# Altium schematic sheet RPI_CM5_PINOUT.SchDoc
size C; SheetNumber: 3; SheetTotal: 20
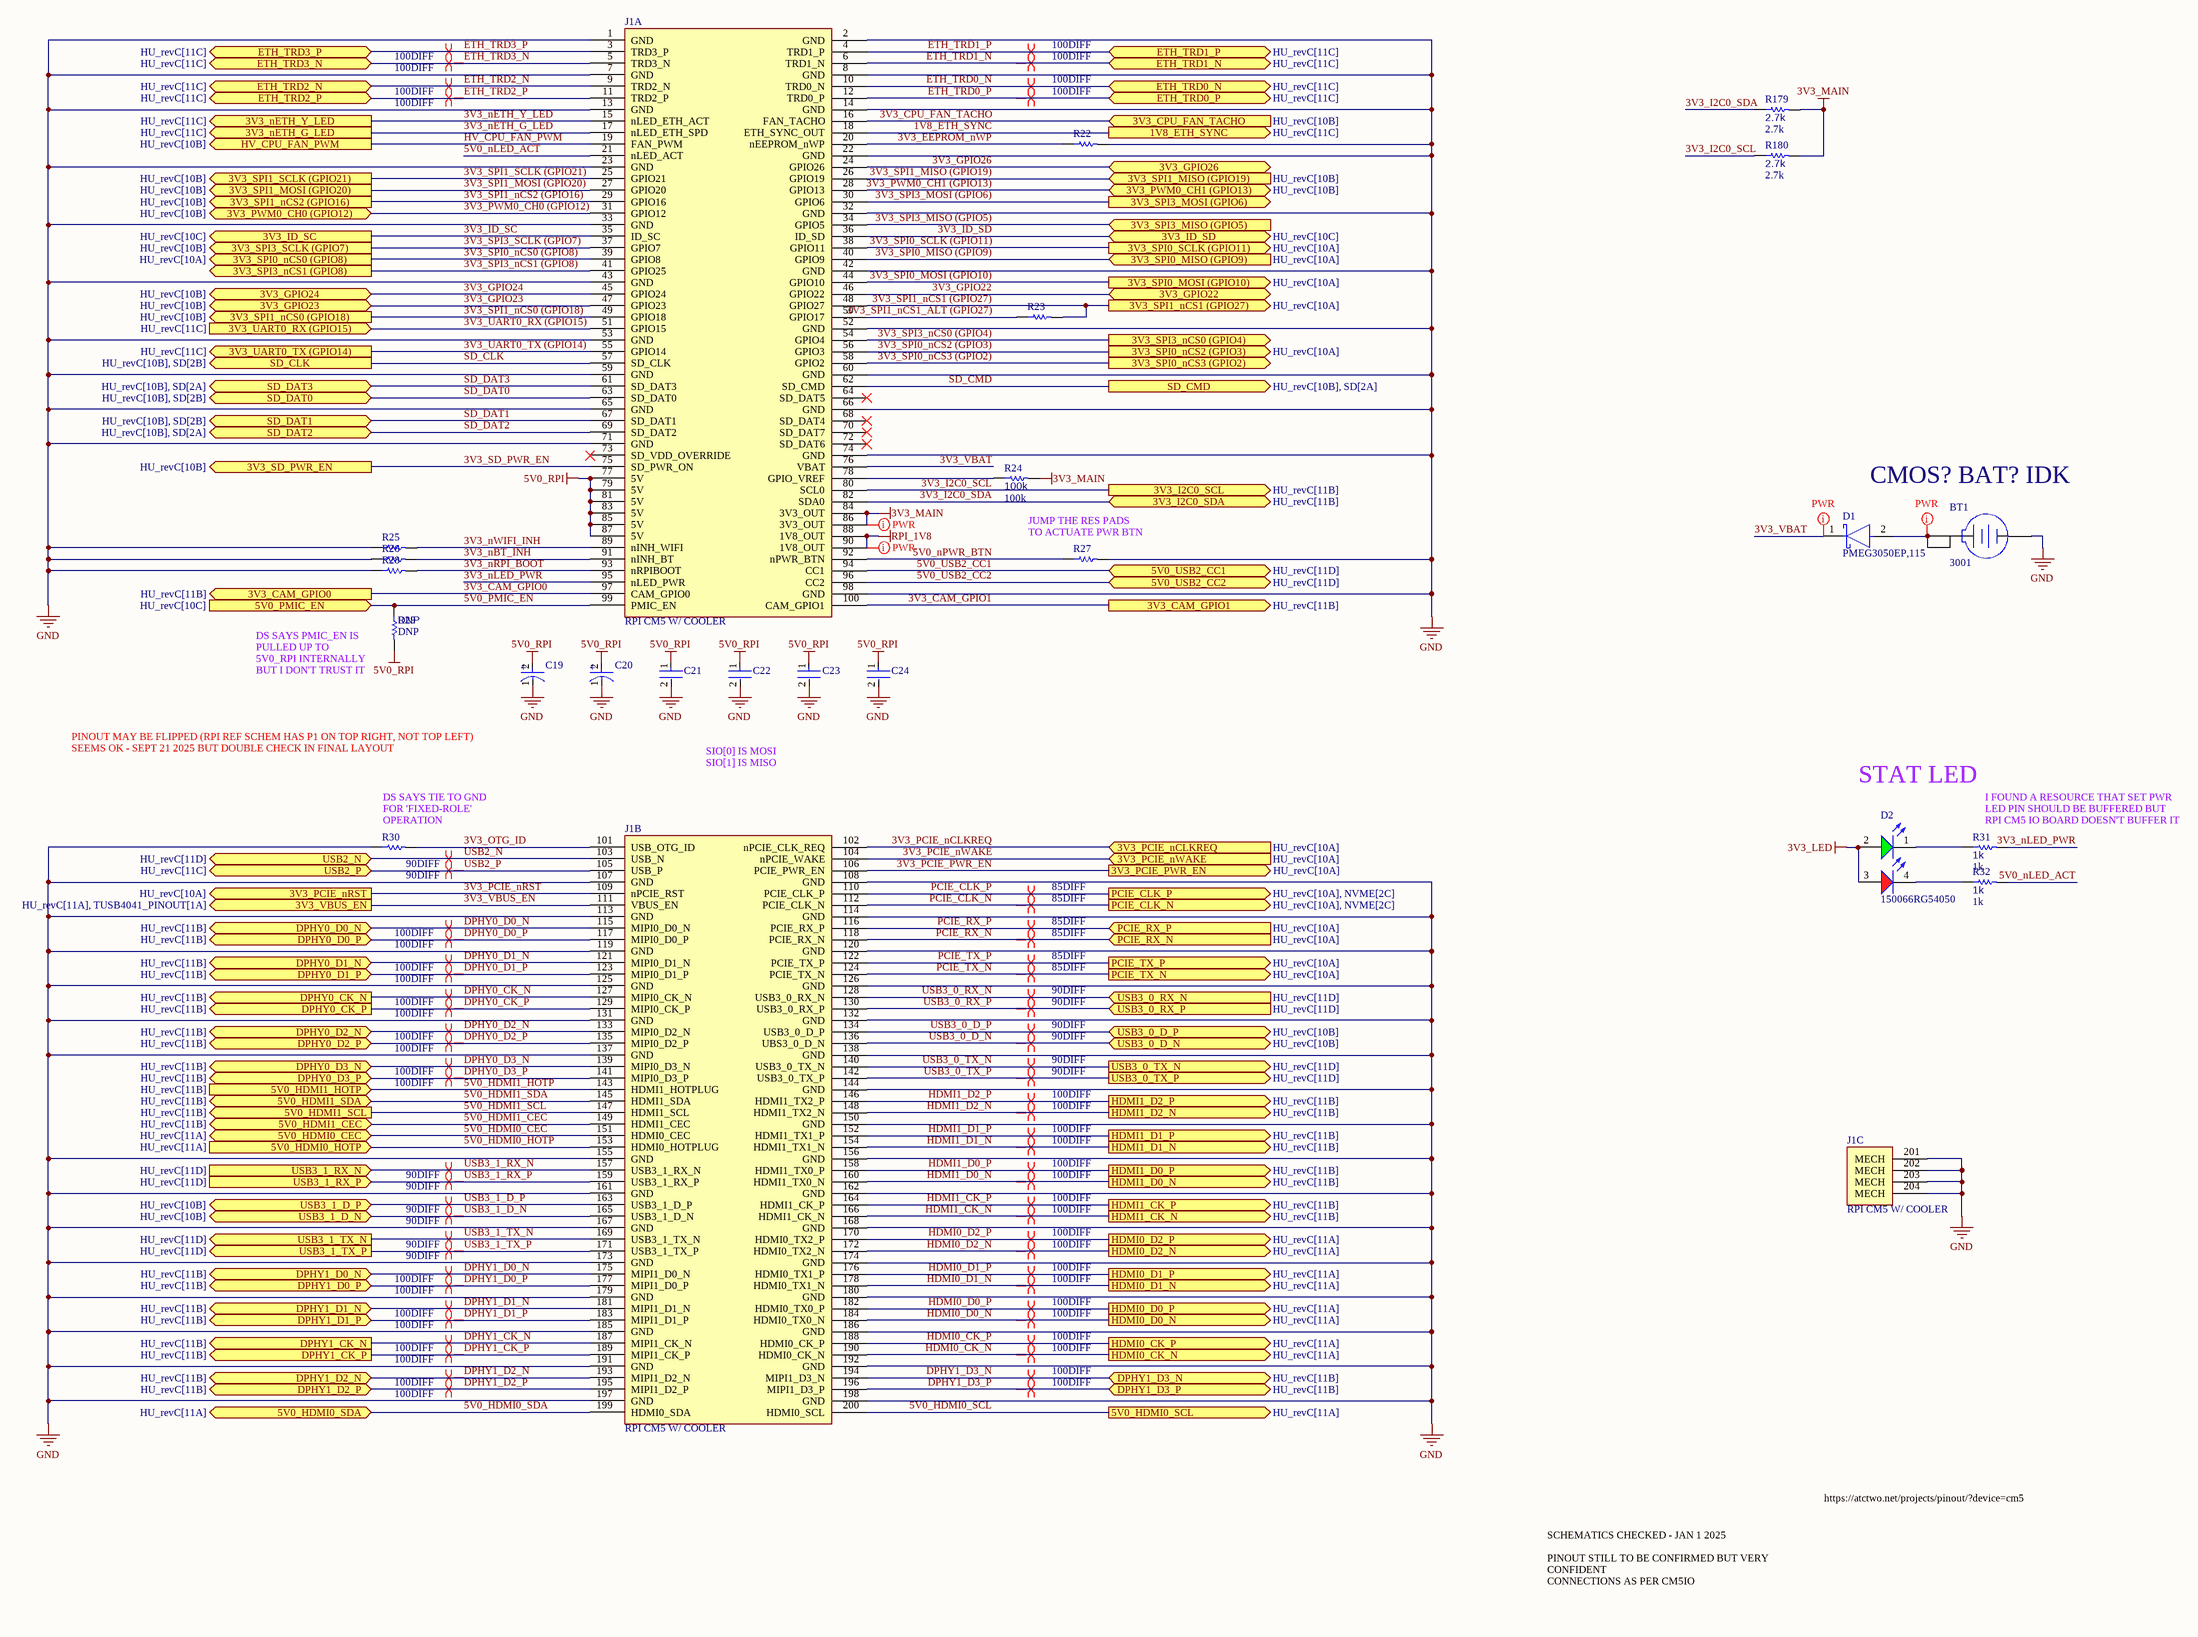
[diagram p0: RPI_CM5_PINOUT.SchDoc]

## Parts
BT1  3001  [KSTN-3001_V]
C19  T491X107K025AT  [FP-T491X107K025AT-MFG]  (value not drawn)
C20  T491X107K025AT  [FP-T491X107K025AT-MFG]  (value not drawn)
C21  C3225X7R1H106M250AC  [FP-C3225-250-0_4-MFG]  (value not drawn)
C22  C3225X7R1H106M250AC  [FP-C3225-250-0_4-MFG]  (value not drawn)
C23  GRM21BR61E226ME44L  [FP-GRM21B-0_2-e0_2_0_7-IPC_B]  (value not drawn)
C24  GRM21BR61E226ME44L  [FP-GRM21B-0_2-e0_2_0_7-IPC_B]  (value not drawn)
D1  PMEG3050EP,115  [FP-SOD128-MFG]
D2  150066RG54050  [WL-SBCD_0606]
J1  RPI CM5 W/ COOLER  [RPI CM5 W_ COOLER-Footprint-1]  (parts A,B,C of 3)
R22  DNP  [RESC1005X40X25ML05T05]  (value not drawn)
R23  DNP  [RESC1005X40X25ML05T05]  (value not drawn)
R24  100k  [R0603B]
R25  DNP  [RESC1005X40X25ML05T05]  (value not drawn)
R26  DNP  [RESC1005X40X25ML05T05]  (value not drawn)
R27  DNP  [RESC1005X40X25ML05T05]  (value not drawn)
R28  DNP  [RESC1005X40X25ML05T05]  (value not drawn)
R29  DNP  [R0603B]
R30  DNP  [RESC1005X40X25ML05T05]  (value not drawn)
R31  1k  [R0603B]
R32  1k  [R0603B]
R179  2.7k  [R0603B]
R180  2.7k  [R0603B]

## Ports
1V8_ETH_SYNC (out, see HU_revC[11C]), 3V3_CAM_GPIO0 (out, see HU_revC[11B]), 3V3_CAM_GPIO1 (out, see HU_revC[11B]), 3V3_CPU_FAN_TACHO (in, see HU_revC[10B]), 3V3_GPIO22 (bidir), 3V3_GPIO23 (bidir, see HU_revC[10B]), 3V3_GPIO24 (bidir, see HU_revC[10B]), 3V3_GPIO26 (bidir), 3V3_I2C0_SCL (out, see HU_revC[11B]), 3V3_I2C0_SDA (bidir, see HU_revC[11B]), 3V3_ID_SC (out, see HU_revC[10C]), 3V3_ID_SD (bidir, see HU_revC[10C]), 3V3_nETH_G_LED (out, see HU_revC[11C]), 3V3_nETH_Y_LED (out, see HU_revC[11C]), 3V3_PCIE_nCLKREQ (in, see HU_revC[10A]), 3V3_PCIE_nRST (out, see HU_revC[10A]), 3V3_PCIE_nWAKE (in, see HU_revC[10A]), 3V3_PCIE_PWR_EN (out, see HU_revC[10A]), 3V3_PWM0_CH0 (GPIO12) (bidir, see HU_revC[10B]), 3V3_PWM0_CH1 (GPIO13) (bidir, see HU_revC[10B]), 3V3_SD_PWR_EN (out, see HU_revC[10B]), 3V3_SPI0_MISO (GPIO9) (in, see HU_revC[10A]), 3V3_SPI0_MOSI (GPIO10) (out, see HU_revC[10A]), 3V3_SPI0_nCS0 (GPIO8) (out, see HU_revC[10A]), 3V3_SPI0_nCS2 (GPIO3) (out, see HU_revC[10A]), 3V3_SPI0_nCS3 (GPIO2) (out), 3V3_SPI0_SCLK (GPIO11) (out, see HU_revC[10A]), 3V3_SPI1_MISO (GPIO19) (in, see HU_revC[10B]), 3V3_SPI1_MOSI (GPIO20) (out, see HU_revC[10B]), 3V3_SPI1_nCS0 (GPIO18) (out, see HU_revC[10B]), 3V3_SPI1_nCS1 (GPIO27) (out, see HU_revC[10A]), 3V3_SPI1_nCS2 (GPIO16) (out, see HU_revC[10B]), 3V3_SPI1_SCLK (GPIO21) (out, see HU_revC[10B]), 3V3_SPI3_MISO (GPIO5) (in), 3V3_SPI3_MOSI (GPIO6) (out), 3V3_SPI3_nCS0 (GPIO4) (out), 3V3_SPI3_nCS1 (GPIO8) (out), 3V3_SPI3_SCLK (GPIO7) (out, see HU_revC[10B]), 3V3_UART0_RX (GPIO15) (in, see HU_revC[11C]), 3V3_UART0_TX (GPIO14) (out, see HU_revC[11C]), 3V3_VBUS_EN (out, see HU_revC[11A], TUSB4041_PINOUT[1A]), 5V0_HDMI0_CEC (bidir, see HU_revC[11A]), 5V0_HDMI0_HOTP (in, see HU_revC[11A]), 5V0_HDMI0_SCL (out, see HU_revC[11A]), 5V0_HDMI0_SDA (bidir, see HU_revC[11A]), 5V0_HDMI1_CEC (bidir, see HU_revC[11B]), 5V0_HDMI1_HOTP (in, see HU_revC[11B]), 5V0_HDMI1_SCL (out, see HU_revC[11B]), 5V0_HDMI1_SDA (bidir, see HU_revC[11B]), 5V0_PMIC_EN (in, see HU_revC[10C]), 5V0_USB2_CC1 (bidir, see HU_revC[11D]), 5V0_USB2_CC2 (bidir, see HU_revC[11D]), DPHY0_CK_N (out, see HU_revC[11B]), DPHY0_CK_P (out, see HU_revC[11B]), DPHY0_D0_N (bidir, see HU_revC[11B]), DPHY0_D0_P (bidir, see HU_revC[11B]), DPHY0_D1_N (bidir, see HU_revC[11B]), DPHY0_D1_P (bidir, see HU_revC[11B]), DPHY0_D2_N (bidir, see HU_revC[11B]), DPHY0_D2_P (bidir, see HU_revC[11B]), DPHY0_D3_N (bidir, see HU_revC[11B]), DPHY0_D3_P (bidir, see HU_revC[11B]), DPHY1_CK_N (out, see HU_revC[11B]), DPHY1_CK_P (out, see HU_revC[11B]), DPHY1_D0_N (bidir, see HU_revC[11B]), DPHY1_D0_P (bidir, see HU_revC[11B]), DPHY1_D1_N (bidir, see HU_revC[11B]), DPHY1_D1_P (bidir, see HU_revC[11B]), DPHY1_D2_N (bidir, see HU_revC[11B]), DPHY1_D2_P (bidir, see HU_revC[11B]), DPHY1_D3_N (bidir, see HU_revC[11B]), DPHY1_D3_P (bidir, see HU_revC[11B]), ETH_TRD0_N (bidir, see HU_revC[11C]), ETH_TRD0_P (bidir, see HU_revC[11C]), ETH_TRD1_N (bidir, see HU_revC[11C]), ETH_TRD1_P (bidir, see HU_revC[11C]), ETH_TRD2_N (bidir, see HU_revC[11C]), ETH_TRD2_P (bidir, see HU_revC[11C]), ETH_TRD3_N (bidir, see HU_revC[11C]), ETH_TRD3_P (bidir, see HU_revC[11C]), HDMI0_CK_N (out, see HU_revC[11A]), HDMI0_CK_P (out, see HU_revC[11A]), HDMI0_D0_N (out, see HU_revC[11A]), HDMI0_D0_P (out, see HU_revC[11A]), HDMI0_D1_N (out, see HU_revC[11A]), HDMI0_D1_P (out, see HU_revC[11A]), HDMI0_D2_N (out, see HU_revC[11A]), HDMI0_D2_P (out, see HU_revC[11A]), HDMI1_CK_N (out, see HU_revC[11B]), HDMI1_CK_P (out, see HU_revC[11B]), HDMI1_D0_N (out, see HU_revC[11B]), HDMI1_D0_P (out, see HU_revC[11B]), HDMI1_D1_N (out, see HU_revC[11B]), HDMI1_D1_P (out, see HU_revC[11B]), HDMI1_D2_N (out, see HU_revC[11B]), HDMI1_D2_P (out, see HU_revC[11B]), HV_CPU_FAN_PWM (out, see HU_revC[10B]), PCIE_CLK_N (out, see HU_revC[10A], NVME[2C]), PCIE_CLK_P (out, see HU_revC[10A], NVME[2C]), PCIE_RX_N (in, see HU_revC[10A]), PCIE_RX_P (in, see HU_revC[10A]), PCIE_TX_N (out, see HU_revC[10A]), PCIE_TX_P (out, see HU_revC[10A]), SD_CLK (out, see HU_revC[10B], SD[2B]), SD_CMD (out, see HU_revC[10B], SD[2A]), SD_DAT0 (bidir, see HU_revC[10B], SD[2B]), SD_DAT1 (bidir, see HU_revC[10B], SD[2B]), SD_DAT2 (bidir, see HU_revC[10B], SD[2A]), SD_DAT3 (bidir, see HU_revC[10B], SD[2A]), USB2_N (bidir, see HU_revC[11D]), USB2_P (bidir, see HU_revC[11C]), USB3_0_D_N (bidir, see HU_revC[10B]), USB3_0_D_P (bidir, see HU_revC[10B]), USB3_0_RX_N (in, see HU_revC[11D]), USB3_0_RX_P (in, see HU_revC[11D]), USB3_0_TX_N (out, see HU_revC[11D]), USB3_0_TX_P (out, see HU_revC[11D]), USB3_1_D_N (bidir, see HU_revC[10B]), USB3_1_D_P (bidir, see HU_revC[10B]), USB3_1_RX_N (in, see HU_revC[11D]), USB3_1_RX_P (in, see HU_revC[11D]), USB3_1_TX_N (out, see HU_revC[11D]), USB3_1_TX_P (out, see HU_revC[11D])

## Nets
3V3_LED: D2.2(A) D2.3(A)
3V3_MAIN: J1.84(3V3_OUT) J1.86(3V3_OUT) R24.2 R179.2 R180.2
5V0_RPI: C19.2(A) C20.2(A) C21.1 C22.1 C23.1 C24.1 J1.77(5V) J1.79(5V) J1.81(5V) J1.83(5V) J1.85(5V) J1.87(5V) R29.2
GND: BT1.3(-) C19.1(C) C20.1(C) C21.2 C22.2 C23.2 C24.2 J1.1(GND) J1.2(GND) J1.7(GND) J1.8(GND) J1.13(GND) J1.14(GND) J1.22(GND) J1.23(GND) J1.32(GND) J1.33(GND) J1.42(GND) J1.43(GND) J1.52(GND) J1.53(GND) J1.59(GND) J1.60(GND) J1.65(GND) J1.66(GND) J1.71(GND) J1.74(GND) J1.98(GND) J1.107(GND) J1.108(GND) J1.113(GND) J1.114(GND) J1.119(GND) J1.120(GND) J1.125(GND) J1.126(GND) J1.131(GND) J1.132(GND) J1.137(GND) J1.138(GND) J1.144(GND) J1.150(GND) J1.155(GND) J1.156(GND) J1.161(GND) J1.162(GND) J1.167(GND) J1.168(GND) J1.173(GND) J1.174(GND) J1.179(GND) J1.180(GND) J1.185(GND) J1.186(GND) J1.191(GND) J1.192(GND) J1.197(GND) J1.198(GND) J1.201(MECH) J1.202(MECH) J1.203(MECH) J1.204(MECH) R22.2 R25.1 R26.1 R27.2 R28.1 R30.1
RPI_1V8: J1.88(1V8_OUT) J1.90(1V8_OUT)
1V8_ETH_SYNC: J1.18(ETH_SYNC_OUT) ; port 1V8_ETH_SYNC
3V3_CAM_GPIO0: J1.97(CAM_GPIO0) ; port 3V3_CAM_GPIO0
3V3_CAM_GPIO1: J1.100(CAM_GPIO1) ; port 3V3_CAM_GPIO1
3V3_CPU_FAN_TACHO: J1.16(FAN_TACHO) ; port 3V3_CPU_FAN_TACHO
3V3_EEPROM_nWP: J1.20(nEEPROM_nWP) R22.1
3V3_GPIO22: J1.46(GPIO22) ; port 3V3_GPIO22
3V3_GPIO23: J1.47(GPIO23) ; port 3V3_GPIO23
3V3_GPIO24: J1.45(GPIO24) ; port 3V3_GPIO24
3V3_GPIO26: J1.24(GPIO26) ; port 3V3_GPIO26
3V3_I2C0_SCL: J1.80(SCL0) R180.1 ; port 3V3_I2C0_SCL
3V3_I2C0_SDA: J1.82(SDA0) R179.1 ; port 3V3_I2C0_SDA
3V3_ID_SC: J1.35(ID_SC) ; port 3V3_ID_SC
3V3_ID_SD: J1.36(ID_SD) ; port 3V3_ID_SD
3V3_nBT_INH: J1.91(nINH_BT) R26.2
3V3_nETH_G_LED: J1.17(nLED_ETH_SPD) ; port 3V3_nETH_G_LED
3V3_nETH_Y_LED: J1.15(nLED_ETH_ACT) ; port 3V3_nETH_Y_LED
3V3_nLED_PWR: J1.95(nLED_PWR) R31.2
3V3_nRPI_BOOT: J1.93(nRPIBOOT) R28.2
3V3_nWIFI_INH: J1.89(nINH_WIFI) R25.2
3V3_OTG_ID: J1.101(USB_OTG_ID) R30.2
3V3_PCIE_nCLKREQ: J1.102(nPCIE_CLK_REQ) ; port 3V3_PCIE_nCLKREQ
3V3_PCIE_nRST: J1.109(nPCIE_RST) ; port 3V3_PCIE_nRST
3V3_PCIE_nWAKE: J1.104(nPCIE_WAKE) ; port 3V3_PCIE_nWAKE
3V3_PCIE_PWR_EN: J1.106(PCIE_PWR_EN) ; port 3V3_PCIE_PWR_EN
3V3_PWM0_CH0 (GPIO12): J1.31(GPIO12) ; port 3V3_PWM0_CH0 (GPIO12)
3V3_PWM0_CH1 (GPIO13): J1.28(GPIO13) ; port 3V3_PWM0_CH1 (GPIO13)
3V3_SD_PWR_EN: J1.75(SD_PWR_ON) ; port 3V3_SD_PWR_EN
3V3_SPI0_MISO (GPIO9): J1.40(GPIO9) ; port 3V3_SPI0_MISO (GPIO9)
3V3_SPI0_MOSI (GPIO10): J1.44(GPIO10) ; port 3V3_SPI0_MOSI (GPIO10)
3V3_SPI0_nCS0 (GPIO8): J1.39(GPIO8) ; port 3V3_SPI0_nCS0 (GPIO8)
3V3_SPI0_nCS2 (GPIO3): J1.56(GPIO3) ; port 3V3_SPI0_nCS2 (GPIO3)
3V3_SPI0_nCS3 (GPIO2): J1.58(GPIO2) ; port 3V3_SPI0_nCS3 (GPIO2)
3V3_SPI0_SCLK (GPIO11): J1.38(GPIO11) ; port 3V3_SPI0_SCLK (GPIO11)
3V3_SPI1_MISO (GPIO19): J1.26(GPIO19) ; port 3V3_SPI1_MISO (GPIO19)
3V3_SPI1_MOSI (GPIO20): J1.27(GPIO20) ; port 3V3_SPI1_MOSI (GPIO20)
3V3_SPI1_nCS0 (GPIO18): J1.49(GPIO18) ; port 3V3_SPI1_nCS0 (GPIO18)
3V3_SPI1_nCS1 (GPIO27): J1.48(GPIO27) R23.2 ; port 3V3_SPI1_nCS1 (GPIO27)
3V3_SPI1_nCS1_ALT (GPIO27): J1.50(GPIO17) R23.1
3V3_SPI1_nCS2 (GPIO16): J1.29(GPIO16) ; port 3V3_SPI1_nCS2 (GPIO16)
3V3_SPI1_SCLK (GPIO21): J1.25(GPIO21) ; port 3V3_SPI1_SCLK (GPIO21)
3V3_SPI3_MISO (GPIO5): J1.34(GPIO5) ; port 3V3_SPI3_MISO (GPIO5)
3V3_SPI3_MOSI (GPIO6): J1.30(GPIO6) ; port 3V3_SPI3_MOSI (GPIO6)
3V3_SPI3_nCS0 (GPIO4): J1.54(GPIO4) ; port 3V3_SPI3_nCS0 (GPIO4)
3V3_SPI3_nCS1 (GPIO8): J1.41(GPIO25) ; port 3V3_SPI3_nCS1 (GPIO8)
3V3_SPI3_SCLK (GPIO7): J1.37(GPIO7) ; port 3V3_SPI3_SCLK (GPIO7)
3V3_UART0_RX (GPIO15): J1.51(GPIO15) ; port 3V3_UART0_RX (GPIO15)
3V3_UART0_TX (GPIO14): J1.55(GPIO14) ; port 3V3_UART0_TX (GPIO14)
3V3_VBAT: D1.1(C) J1.76(VBAT)
3V3_VBUS_EN: J1.111(VBUS_EN) ; port 3V3_VBUS_EN
5V0_HDMI0_CEC: J1.151(HDMI0_CEC) ; port 5V0_HDMI0_CEC
5V0_HDMI0_HOTP: J1.153(HDMI0_HOTPLUG) ; port 5V0_HDMI0_HOTP
5V0_HDMI0_SCL: J1.200(HDMI0_SCL) ; port 5V0_HDMI0_SCL
5V0_HDMI0_SDA: J1.199(HDMI0_SDA) ; port 5V0_HDMI0_SDA
5V0_HDMI1_CEC: J1.149(HDMI1_CEC) ; port 5V0_HDMI1_CEC
5V0_HDMI1_HOTP: J1.143(HDMI1_HOTPLUG) ; port 5V0_HDMI1_HOTP
5V0_HDMI1_SCL: J1.147(HDMI1_SCL) ; port 5V0_HDMI1_SCL
5V0_HDMI1_SDA: J1.145(HDMI1_SDA) ; port 5V0_HDMI1_SDA
5V0_nLED_ACT: J1.21(nLED_ACT) R32.2
5V0_nPWR_BTN: J1.92(nPWR_BTN) R27.1
5V0_PMIC_EN: J1.99(PMIC_EN) R29.1 ; port 5V0_PMIC_EN
5V0_USB2_CC1: J1.94(CC1) ; port 5V0_USB2_CC1
5V0_USB2_CC2: J1.96(CC2) ; port 5V0_USB2_CC2
DPHY0_CK_N: J1.127(MIPI0_CK_N) ; port DPHY0_CK_N
DPHY0_CK_P: J1.129(MIPI0_CK_P) ; port DPHY0_CK_P
DPHY0_D0_N: J1.115(MIPI0_D0_N) ; port DPHY0_D0_N
DPHY0_D0_P: J1.117(MIPI0_D0_P) ; port DPHY0_D0_P
DPHY0_D1_N: J1.121(MIPI0_D1_N) ; port DPHY0_D1_N
DPHY0_D1_P: J1.123(MIPI0_D1_P) ; port DPHY0_D1_P
DPHY0_D2_N: J1.133(MIPI0_D2_N) ; port DPHY0_D2_N
DPHY0_D2_P: J1.135(MIPI0_D2_P) ; port DPHY0_D2_P
DPHY0_D3_N: J1.139(MIPI0_D3_N) ; port DPHY0_D3_N
DPHY0_D3_P: J1.141(MIPI0_D3_P) ; port DPHY0_D3_P
DPHY1_CK_N: J1.187(MIPI1_CK_N) ; port DPHY1_CK_N
DPHY1_CK_P: J1.189(MIPI1_CK_P) ; port DPHY1_CK_P
DPHY1_D0_N: J1.175(MIPI1_D0_N) ; port DPHY1_D0_N
DPHY1_D0_P: J1.177(MIPI1_D0_P) ; port DPHY1_D0_P
DPHY1_D1_N: J1.181(MIPI1_D1_N) ; port DPHY1_D1_N
DPHY1_D1_P: J1.183(MIPI1_D1_P) ; port DPHY1_D1_P
DPHY1_D2_N: J1.193(MIPI1_D2_N) ; port DPHY1_D2_N
DPHY1_D2_P: J1.195(MIPI1_D2_P) ; port DPHY1_D2_P
DPHY1_D3_N: J1.194(MIPI1_D3_N) ; port DPHY1_D3_N
DPHY1_D3_P: J1.196(MIPI1_D3_P) ; port DPHY1_D3_P
ETH_TRD0_N: J1.10(TRD0_N) ; port ETH_TRD0_N
ETH_TRD0_P: J1.12(TRD0_P) ; port ETH_TRD0_P
ETH_TRD1_N: J1.6(TRD1_N) ; port ETH_TRD1_N
ETH_TRD1_P: J1.4(TRD1_P) ; port ETH_TRD1_P
ETH_TRD2_N: J1.9(TRD2_N) ; port ETH_TRD2_N
ETH_TRD2_P: J1.11(TRD2_P) ; port ETH_TRD2_P
ETH_TRD3_N: J1.5(TRD3_N) ; port ETH_TRD3_N
ETH_TRD3_P: J1.3(TRD3_P) ; port ETH_TRD3_P
HDMI0_CK_N: J1.190(HDMI0_CK_N) ; port HDMI0_CK_N
HDMI0_CK_P: J1.188(HDMI0_CK_P) ; port HDMI0_CK_P
HDMI0_D0_N: J1.184(HDMI0_TX0_N) ; port HDMI0_D0_N
HDMI0_D0_P: J1.182(HDMI0_TX0_P) ; port HDMI0_D0_P
HDMI0_D1_N: J1.178(HDMI0_TX1_N) ; port HDMI0_D1_N
HDMI0_D1_P: J1.176(HDMI0_TX1_P) ; port HDMI0_D1_P
HDMI0_D2_N: J1.172(HDMI0_TX2_N) ; port HDMI0_D2_N
HDMI0_D2_P: J1.170(HDMI0_TX2_P) ; port HDMI0_D2_P
HDMI1_CK_N: J1.166(HDMI1_CK_N) ; port HDMI1_CK_N
HDMI1_CK_P: J1.164(HDMI1_CK_P) ; port HDMI1_CK_P
HDMI1_D0_N: J1.160(HDMI1_TX0_N) ; port HDMI1_D0_N
HDMI1_D0_P: J1.158(HDMI1_TX0_P) ; port HDMI1_D0_P
HDMI1_D1_N: J1.154(HDMI1_TX1_N) ; port HDMI1_D1_N
HDMI1_D1_P: J1.152(HDMI1_TX1_P) ; port HDMI1_D1_P
HDMI1_D2_N: J1.148(HDMI1_TX2_N) ; port HDMI1_D2_N
HDMI1_D2_P: J1.146(HDMI1_TX2_P) ; port HDMI1_D2_P
HV_CPU_FAN_PWM: J1.19(FAN_PWM) ; port HV_CPU_FAN_PWM
PCIE_CLK_N: J1.112(PCIE_CLK_N) ; port PCIE_CLK_N
PCIE_CLK_P: J1.110(PCIE_CLK_P) ; port PCIE_CLK_P
PCIE_RX_N: J1.118(PCIE_RX_N) ; port PCIE_RX_N
PCIE_RX_P: J1.116(PCIE_RX_P) ; port PCIE_RX_P
PCIE_TX_N: J1.124(PCIE_TX_N) ; port PCIE_TX_N
PCIE_TX_P: J1.122(PCIE_TX_P) ; port PCIE_TX_P
SD_CLK: J1.57(SD_CLK) ; port SD_CLK
SD_CMD: J1.62(SD_CMD) ; port SD_CMD
SD_DAT0: J1.63(SD_DAT0) ; port SD_DAT0
SD_DAT1: J1.67(SD_DAT1) ; port SD_DAT1
SD_DAT2: J1.69(SD_DAT2) ; port SD_DAT2
SD_DAT3: J1.61(SD_DAT3) ; port SD_DAT3
USB2_N: J1.103(USB_N) ; port USB2_N
USB2_P: J1.105(USB_P) ; port USB2_P
USB3_0_D_N: J1.136(UBS3_0_D_N) ; port USB3_0_D_N
USB3_0_D_P: J1.134(USB3_0_D_P) ; port USB3_0_D_P
USB3_0_RX_N: J1.128(USB3_0_RX_N) ; port USB3_0_RX_N
USB3_0_RX_P: J1.130(USB3_0_RX_P) ; port USB3_0_RX_P
USB3_0_TX_N: J1.140(USB3_0_TX_N) ; port USB3_0_TX_N
USB3_0_TX_P: J1.142(USB3_0_TX_P) ; port USB3_0_TX_P
USB3_1_D_N: J1.165(USB3_1_D_N) ; port USB3_1_D_N
USB3_1_D_P: J1.163(USB3_1_D_P) ; port USB3_1_D_P
USB3_1_RX_N: J1.157(USB3_1_RX_N) ; port USB3_1_RX_N
USB3_1_RX_P: J1.159(USB3_1_RX_P) ; port USB3_1_RX_P
USB3_1_TX_N: J1.169(USB3_1_TX_N) ; port USB3_1_TX_N
USB3_1_TX_P: J1.171(USB3_1_TX_P) ; port USB3_1_TX_P
NetBT1_1: BT1.1(+) BT1.2(+) D1.2(A)
NetD2_1: D2.1(K) R31.1
NetD2_4: D2.4(K) R32.1
NetJ1_78: J1.78(GPIO_VREF) R24.1

Not connected (* = marked no-connect by the designer): J1 64(SD_DAT5)* 68(SD_DAT4)* 70(SD_DAT7)* 72(SD_DAT6)* 73(SD_VDD_OVERRIDE)*

## Layout directives
net class PWR: 3V3_MAIN, 3V3_VBAT, NetBT1_1, RPI_1V8
differential pair; differential pair class 100DIFF: DPHY0_CK_N, DPHY0_CK_P, DPHY0_D0_N, DPHY0_D0_P, DPHY0_D1_N, DPHY0_D1_P, DPHY0_D2_N, DPHY0_D2_P, DPHY0_D3_N, DPHY0_D3_P, DPHY1_CK_N, DPHY1_CK_P, DPHY1_D0_N, DPHY1_D0_P, DPHY1_D1_N, DPHY1_D1_P, DPHY1_D2_N, DPHY1_D2_P, DPHY1_D3_N, DPHY1_D3_P, ETH_TRD0_N, ETH_TRD0_P, ETH_TRD1_N, ETH_TRD1_P, ETH_TRD2_N, ETH_TRD2_P, ETH_TRD3_N, ETH_TRD3_P, HDMI0_CK_N, HDMI0_CK_P, HDMI0_D0_N, HDMI0_D0_P, HDMI0_D1_N, HDMI0_D1_P, HDMI0_D2_N, HDMI0_D2_P, HDMI1_CK_N, HDMI1_CK_P, HDMI1_D0_N, HDMI1_D0_P, HDMI1_D1_N, HDMI1_D1_P, HDMI1_D2_N, HDMI1_D2_P
differential pair; differential pair class 90DIFF: USB2_N, USB2_P, USB3_0_D_N, USB3_0_D_P, USB3_0_RX_N, USB3_0_RX_P, USB3_0_TX_N, USB3_0_TX_P, USB3_1_D_N, USB3_1_D_P, USB3_1_RX_N, USB3_1_RX_P, USB3_1_TX_N, USB3_1_TX_P
differential pair; differential pair class 85DIFF: PCIE_CLK_N, PCIE_CLK_P, PCIE_RX_N, PCIE_RX_P, PCIE_TX_N, PCIE_TX_P

## Notes on the sheet
- CMOS? BAT? IDK
- JUMP THE RES PADS TO ACTUATE PWR BTN
- (near R29) DS SAYS PMIC_EN IS PULLED UP TO 5V0_RPI INTERNALLY BUT I DON'T TRUST IT
- PINOUT MAY BE FLIPPED (RPI REF SCHEM HAS P1 ON TOP RIGHT, NOT TOP LEFT)
- SEEMS OK - SEPT 21 2025 BUT DOUBLE CHECK IN FINAL LAYOUT
- SIO[0] IS MOSI
  SIO[1] IS MISO
- STAT LED
- (near R30) DS SAYS TIE TO GND FOR 'FIXED-ROLE' OPERATION
- (near R31) I FOUND A RESOURCE THAT SET PWR LED PIN SHOULD BE BUFFERED BUT RPI CM5 IO BOARD DOESN'T BUFFER IT
- https://atctwo.net/projects/pinout/?device=cm5
- SCHEMATICS CHECKED - JAN 1 2025
  PINOUT STILL TO BE CONFIRMED BUT VERY CONFIDENT
  CONNECTIONS AS PER CM5IO
- (in symbol CMP-2000-07204-2) +

## Library data of the parts
BT1 = CMP-2000-05463-1: Holder Battery Coin, 12 mm, 2-Pin THD, RoHS; Manufacturer: Keystone; Package Reference: 3001; Package Description: 2-Pin Through Hole Device, Body 13.21 x 12.07 mm; Datasheet Version: Rev. H, 09/2006; Datasheet URL: https://datasheet.ciiva.com/3/3001-3954.pdf; Mounting Technology: ThroughHole; Manufacturer URL: http://www.keyelco.com/
C19 C20 = CMP-2000-07204-2: CAP TANT 100UF 10% 25V 2917; Leakage Current: 25uA; Ripple Current: 742mA; Polarity: Polar; Dissipation Factor: 8%; Life (Hours): 2000Hour; Dielectric Material: Tantalum; ESR (Equivalent Series Resistance): 300mR; Length: 7.3mm; RoHS Compliant: No; Failure Rate: 0.001%; REACH SVHC: No SVHC; Tolerance: 10%; Mount: Surface Mount; Height - Seated (Max): 0.169inch; Features: General Purpose; Height: 4mm; Package Quantity: 1; Case Code (Metric): 7343; Max Operating Temperature: 125°C; Number of Pins: 2; Radiation Hardening: No; Lead Free: Lead Free; Capacitance: 100uF; Termination: SMD/SMT; Voltage Rating: 25V; Series: T491; Depth: 4.3mm; Construction: Flat; Case/Package: 2917; Min Operating Temperature: -55°C; Voltage Rating (DC): 25V; Width: 4.3mm; Packaging: Tape and Reel; Case Code (Imperial): 2917; Voltage: 25V
C21 C22 = CMP-08246-002653-1: Multilayer Ceramic Capacitors 10uF ±20% 50V X7R SMD 1210; Width: 0.098inch; Package Quantity: 1000; Height: 2.5mm; Dielectric Material: Ceramic; Voltage Rating: 50V; Series: C; Capacitance: 10uF; Tolerance: 20%; Weight: 0.000564oz; Case/Package: 1210; Case Code (Imperial): 1210; Dielectric: X7R; Case Code (Metric): 3225; REACH SVHC: No SVHC; Packaging: Tape and Reel; Length: 0.126inch; Termination: SMD/SMT; Min Operating Temperature: -55°C; Voltage Rating (DC): 50V; Lead Free: Lead Free; Max Operating Temperature: 125°C; Thickness: 0.11inch; Mount: Surface Mount
C23 C24 = CMP-2007-03222-3: Chip Multilayer Ceramic Capacitors for General Purpose, 0805, 22uF, X5R, 15%, 20%, 25V; Case/Package: 0805; Depth: 1.25mm; Resistor Type: Ceramic; Voltage Rating: 25V; Lead Free: Lead Free; Voltage Rating (DC): 25V; Case Code (Metric): 2012; Thickness: 0.057inch; REACH SVHC: No SVHC; Material: Ceramic; Tolerance: 20%; Length: 2mm; Capacitance: 22uF; Case Code (Imperial): 0805; Max Operating Temperature: 85°C; Termination: SMD/SMT; Weight: 0.000335oz; Dielectric: X5R; Packaging: Tape and Reel; Voltage: 25V; Package Quantity: 3000; Height: 1.25mm; Mount: Surface Mount; Width: 1.25mm; Min Operating Temperature: -55°C
D1 = CMP-14398-000051-1: DIODE SCHOTTKY 30V 5A SOD128; RoHS Compliant: Yes
D2 = CMP-004-00040-2: Led, Red/Grn, 180Mcd/230Mcd, 624Nm/525Nm Rohs Compliant: Yes; Source: rgled.SchLib; Component Type: Standard; Pins: 4; Design Item ID: CMP-004-00034-2
J1 = CMP-00028-00005-4: Mechanical placeholder for RPI CM5 w/ active cooler on it
R22 R23 R25-R28 R30 = CMP-009-00118-2: READ THE NAME; Pins: 2; Component Type: Standard; Design Item ID: CMP-009-00206-2; Source: 0402jump.SchLib
R24 R29 R31 R32 R179 R180 = CMP-009-00002-14: Resistor
  R24: Value: 100k
  R29: Value: DNP
  R31 R32: Value: 1k
  R179 R180: Value: 2.7k